# EAGLE design RedLightFlashlightInsert (EAGLE 9.6.2)
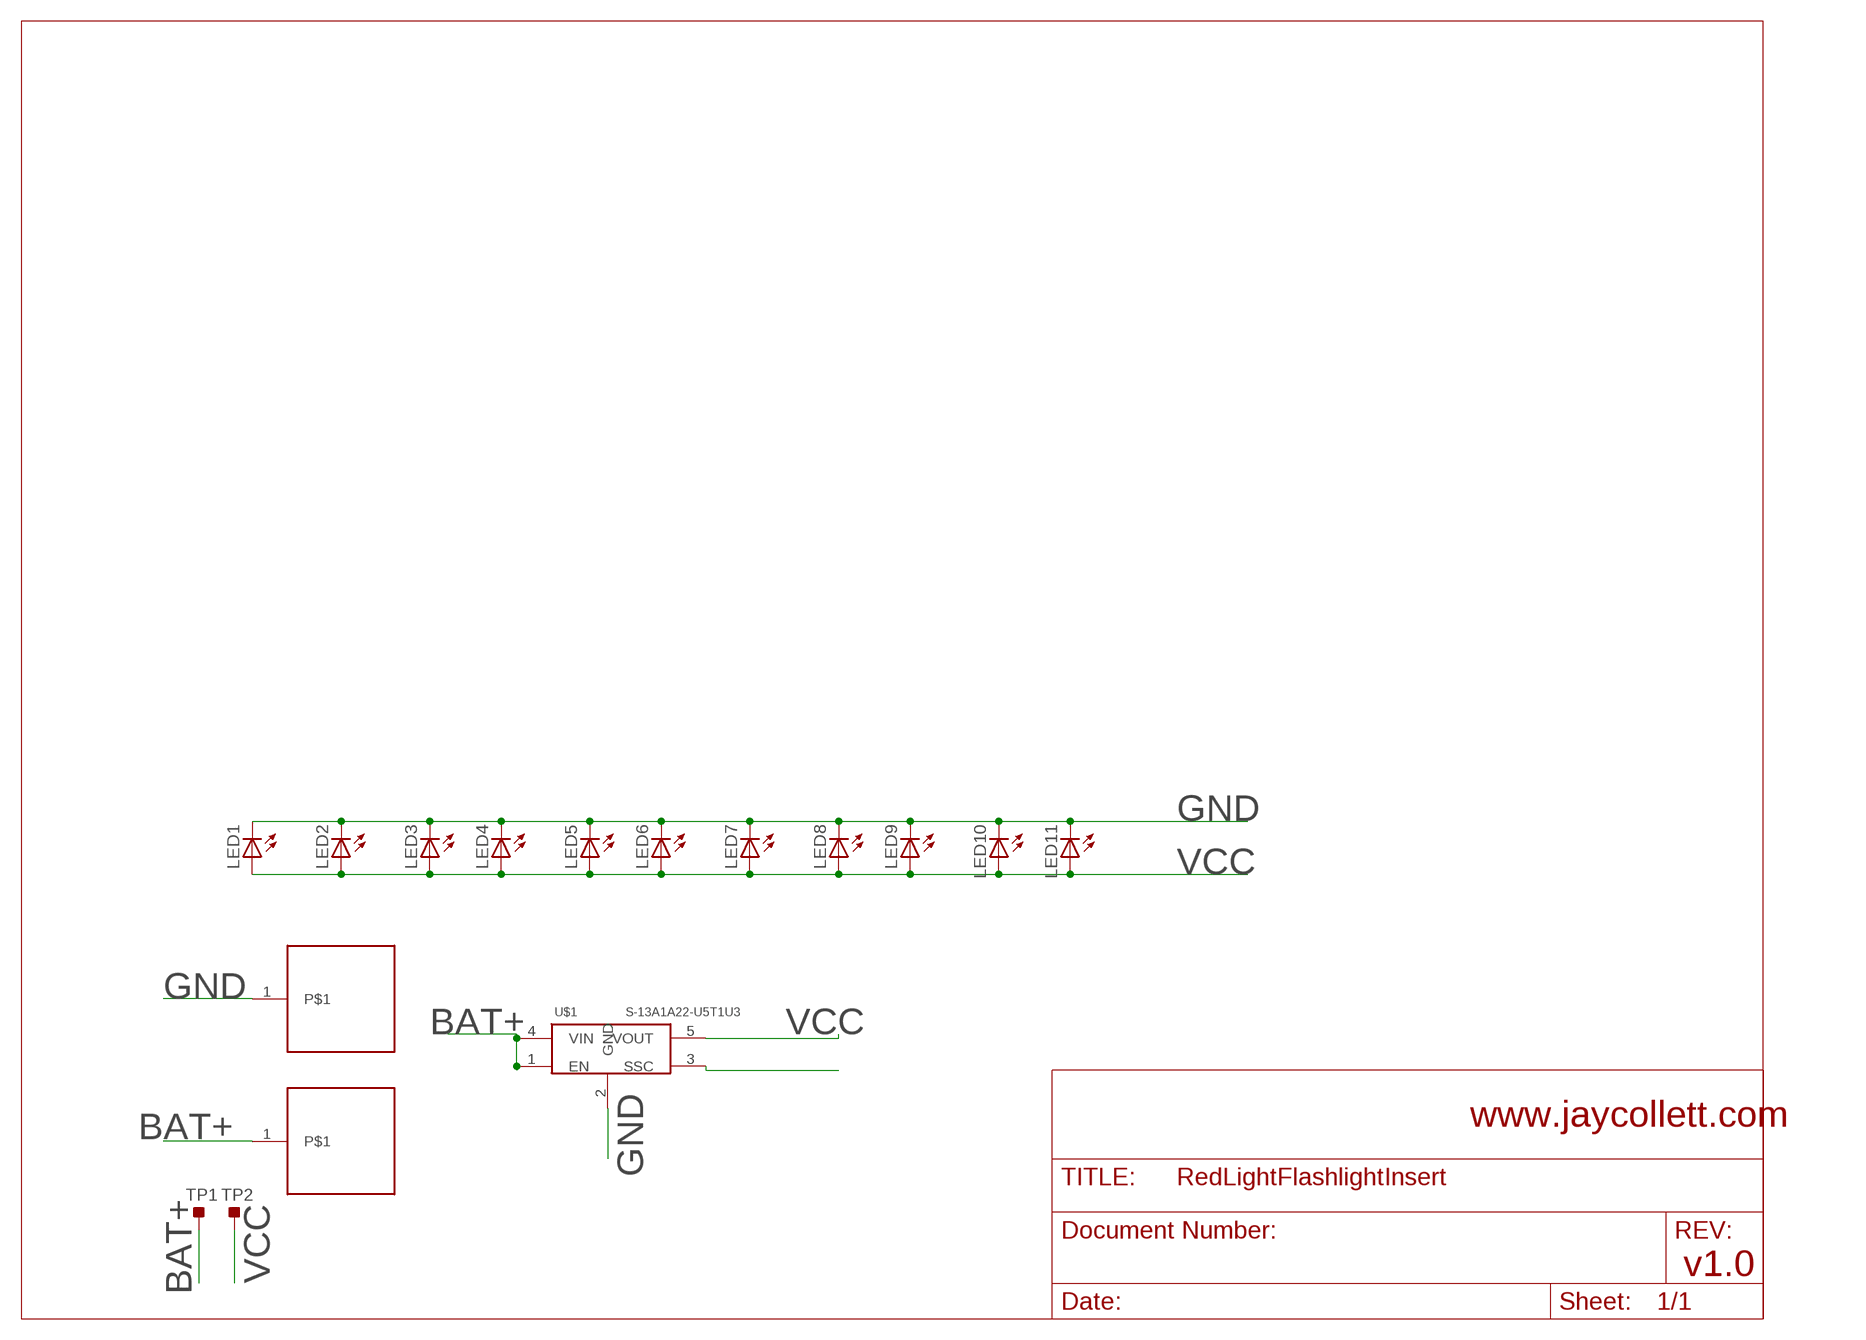
[diagram p0: schematic, sheet 1]

## Parts
LED1  LED5MM  [LED5MM]
LED2  LED5MM  [LED5MM]
LED3  LED5MM  [LED5MM]
LED4  LED5MM  [LED5MM]
LED5  LED5MM  [LED5MM]
LED6  LED5MM  [LED5MM]
LED7  LED5MM  [LED5MM]
LED8  LED5MM  [LED5MM]
LED9  LED5MM  [LED5MM]
LED10  LED5MM  [LED5MM]
LED11  LED5MM  [LED5MM]
TP1  TESTPOINT_TPS-SMD-10SN  [TESTPOINT_SMD-10SN]
TP2  TESTPOINT_TPS-SMD-10SN  [TESTPOINT_SMD-10SN]
U$1  S-13A1A22-U5T1U3  [SOT-89-5]
U$2  SOLDERPAD  [SOLDERPAD]
U$3  SOLDERPAD  [SOLDERPAD]

## Nets
BAT+: TP1.TP U$1.1(EN) U$1.4(VIN) U$3.1
GND: LED1.K(C) LED2.K(C) LED3.K(C) LED4.K(C) LED5.K(C) LED6.K(C) LED7.K(C) LED8.K(C) LED9.K(C) LED10.K(C) LED11.K(C) U$1.2(GND) U$2.1
N$4: U$1.3(SSC)
VCC: LED1.A LED2.A LED3.A LED4.A LED5.A LED6.A LED7.A LED8.A LED9.A LED10.A LED11.A TP2.TP U$1.5(VOUT)

## Notes on the sheet
- www.jaycollett.com
- v1.0

## Library data of the parts
LED1-LED11 = adafruit:LED: LED OSRAM: - CHIPLED LG R971, LG N971, LY N971, LG Q971, LY Q971, LO R971, LY R971 LH N974, LH R974 LS Q976, LO Q976, LY Q976 LO Q996 - Hyper CHIPLED LW Q18S LB Q993, LB Q99A, LB R99A - SideLED LS A670, LO A670, LY A670, LG A670, LP A670 LB A673, LV A673, LT A673, LW A673 LH A674 LY A675 LS A676, LA A676, LO A676, LY A676, LW A676 LS A679, LY A679, LG A679 - Hyper Micro SIDELED® LS Y876, LA Y876, LO Y876, LY Y876 LT Y87S - SmartLED LW L88C, LW L88S LB L89C, LB L89S, LG L890 LS L89K, LO L89K, LY L89K LS L896, LA L896, LO L896, LY L896 - TOPLED LS T670, LO T670, LY T670, LG T670, LP T670 LSG T670, LSP T670, LSY T670, LOP T670, LYG T670 LG T671, LOG T671, LSG T671 LB T673, LV T673, LT T673, LW T673 LH T674 LS T676, LA T676, LO T676, LY T676, LB T676, LH T676, LSB T676, LW T676 LB T67C, LV T67C, LT T67C, LS T67K, LO T67K, LY T67K, LW E67C LS E67B, LA E67B, LO E67B, LY E67B, LB E67C, LV E67C, LT E67C LW T67C LS T679, LY T679, LG T679 LS T770, LO T770, LY T770, LG T770, LP T770 LB T773, LV T773, LT T773, LW T773 LH T774 LS E675, LA E675, LY E675, LS T675 LS T776, LA T776, LO T776, LY T776, LB T776 LHGB T686 LT T68C, LB T68C - Hyper Mini TOPLED® LB M676 - Mini TOPLED Santana® LG M470 LS M47K, LO M47K, LY M47K Source: http://www.osram.convergy.de/
TP1 TP2 = 52101-101-REV-A_v16:TESTPOINT_TPS: TEST POINT PAD; BOM: EXCLUDE
U$1 = ablic:S-13A1A22-U5T1U3: IC REG LINEAR 2.2V 1A SOT8905 by ABLIC U.S.A. Inc.
U$2 U$3 = JayCollett:SOLDERPAD

## Board
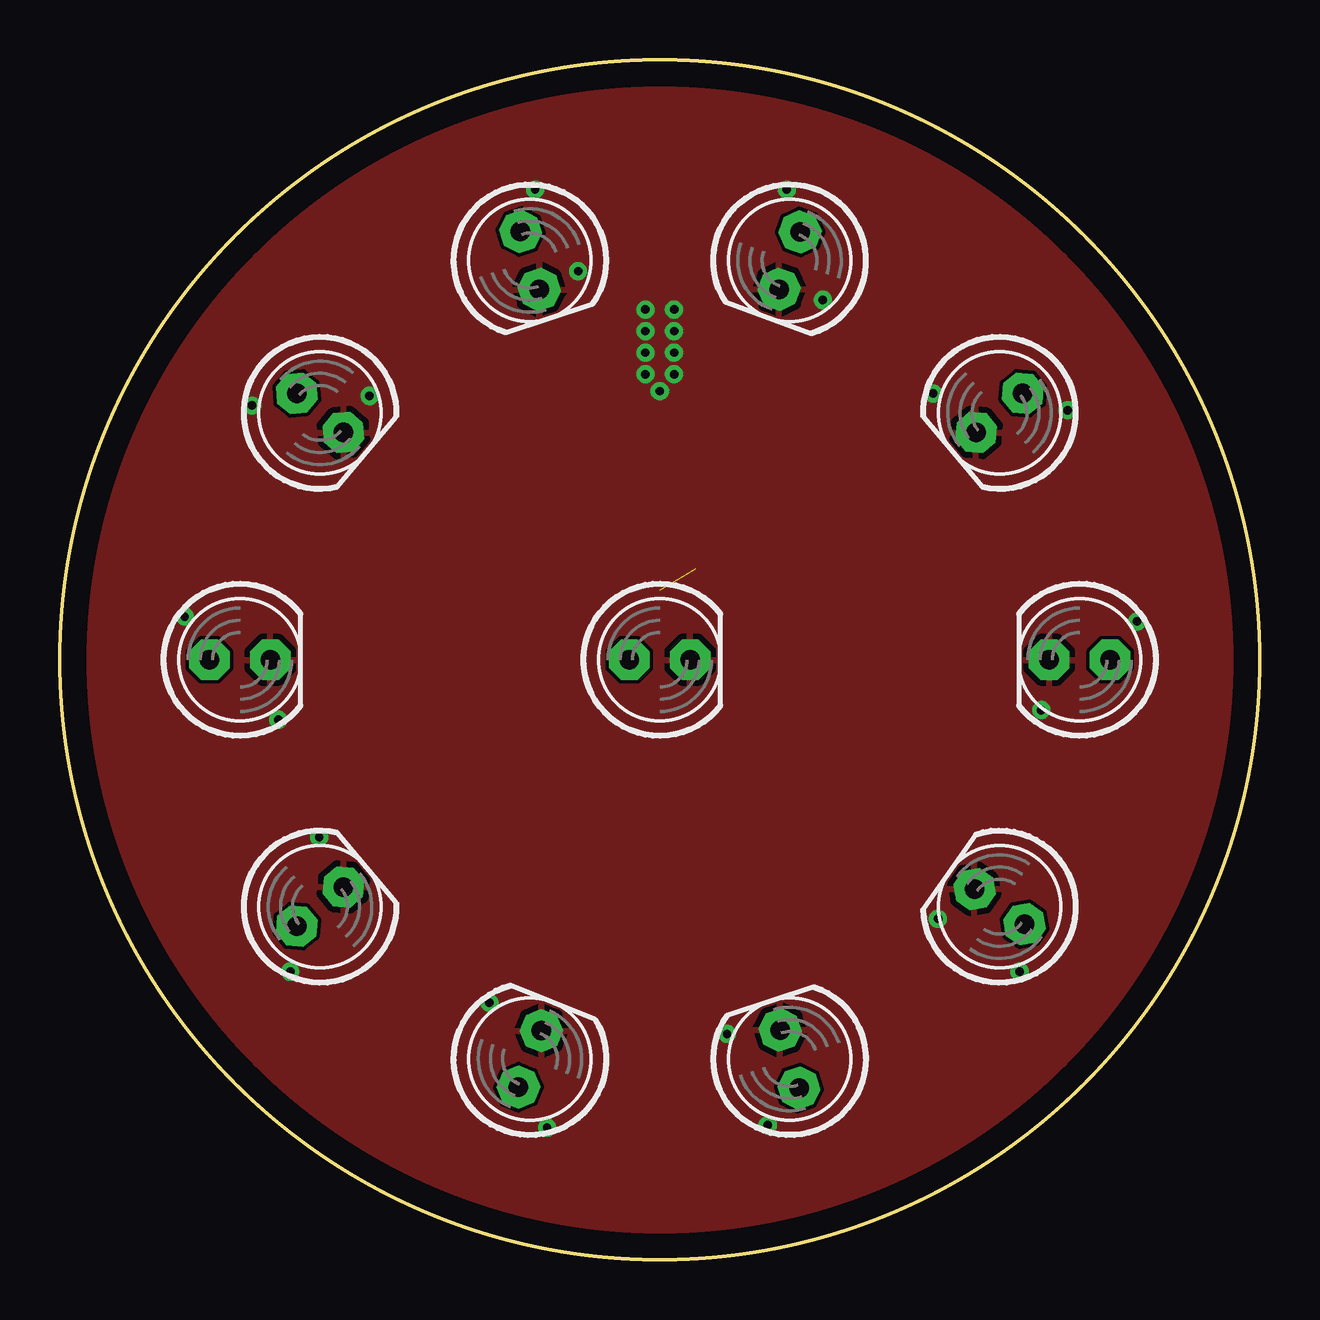
[diagram p1: board, top side]
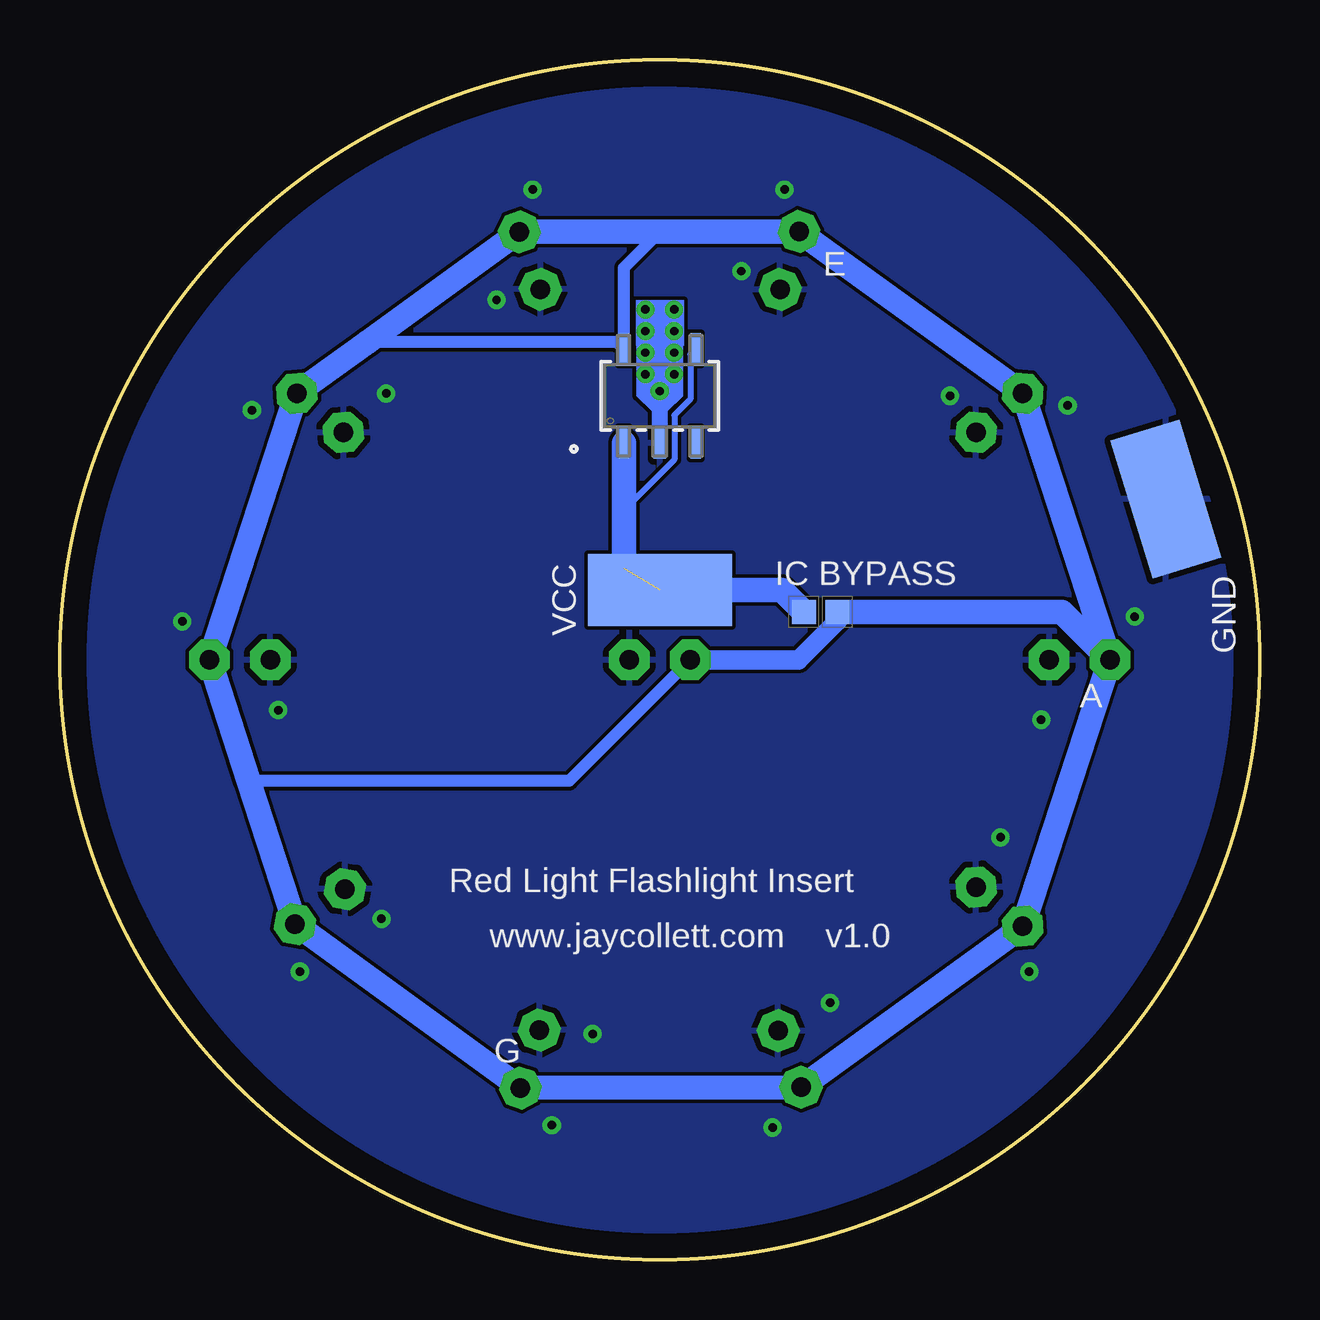
[diagram p2: board, bottom side, seen from below]

Size 50 x 50 mm. Coordinates in mm from the lower left corner, seen from the top.
Outline: circle at 25,25 radius 25
Copper layers (1*16): Top 0.035mm / dielectric 1.5mm / Bottom 0.035mm
Design rules "default *": minimum track width 6mil, minimum drill 0.35mm, track to track 6mil, track to pad 6mil, pad to pad 6mil, via to via 6mil, smd to smd 6mil, copper to edge 40mil, drill to drill 6mil, minimum pad ring 10mil, minimum via ring 8mil, stop-mask expansion 4mil, vias tented up to drill 15mil, thermal gap 10mil

### Footprints (pad centres in the part's own frame; a part is rotated, then mirrored left to right if it is on the bottom)
LED5MM = drill 0.813 pad 1.676 octagon: A -1.27,0; K 1.27,0
TESTPOINT_SMD-10SN = smd 1 x 1: TP 0,0
SOT-89-5 = smd 0.432 x 1.321: 1 -1.5,-1.96; 3 1.5,-1.96; 4 1.5,1.96; 5 -1.5,1.96 | smd 0.508 x 1.321: 2 0,-1.96
SOLDERPAD = smd 3 x 6: 1 0,0

### Placement (x,y rotation side)
LED1  39.16,35.29 220 top
LED2  30.41,41.64 250 top
LED3  19.59,41.64 288 top
LED4  10.84,35.29 320 top
LED5  7.5,25 0 top
LED6  10.84,14.71 40 top
LED7  19.59,8.36 68 top
LED8  30.41,8.36 108 top
LED9  39.16,14.71 145 top
LED10  42.5,25 180 top
LED11  25,25 0 top
TP1  19,27 90 bottom
TP2  17.6,27 90 bottom
U$1  25,36 0 bottom
U$2  3.9,31.7 17 bottom
U$3  25,27.9 90 bottom

### Tracks (layer width: path | path; a pad name or v marks a point on that pad's centre or on a via)
BAT+  (1 unrouted)
  Bottom 0.254: U$1.4 23.72,37.74 23.72,35.86 24.39,35.19 24.39,33.34 26.5,31.23 26.5,31
  Bottom 1.016: 26.5,28.8 26.5,31 U$1.1 | U$3.1 19.9,27.9 TP1.TP
GND  (via drill 0.35)
  other vias: 21.6,41.2 31.8,40 12.9,36 5.2,26.8 19.8,44.6 30.3,44.6 8,35.6 42,35.4 36.4,36.1 44.9,26.6 40.9,22.9 40,12 36.6,14.2 27.8,9.4 29.5,5.6 17.9,10.7 20.3,5.5 10.8,17.6 9.6,12 9.1,22.5 24.4,39.6 25.6,39.6 25.6,38.7 24.4,38.7 24.4,37.8 25.6,37.8 25.6,36.9 24.4,36.9 25,36.2
  pour Bottom: 25,49.8 arc90 0.2,25 arc90 25,0.2 arc90 49.8,25 arc90
  pour Top: 25,49.8 arc90 0.2,25 arc90 25,0.2 arc90 49.8,25 arc90
VCC
  Bottom 0.508: 25,42.84 26.5,41.34 U$1.5 26.79,38.25 37.18,38.25 | LED11.A 28.77,19.96 42.14,19.96
  Bottom 0.813: TP2.TP 17.6,26.61 19.21,25 LED11.A
  Bottom 1.016: TP2.TP 8.23,27 LED5.A | LED5.A LED4.A LED3.A 25,42.84 LED2.A 37.18,38.25 LED1.A LED10.A 42.14,19.96 LED9.A LED8.A LED7.A LED6.A LED5.A
(copper drawn outside any net)
  shapes: Bottom area x2

### Text on the board
bPlace: E | GND | VCC | IC BYPASS | A | Red Light Flashlight Insert | v1.0 | www.jaycollett.com | G